# Altium schematic sheet 990207_Schematic.SchDoc
size A
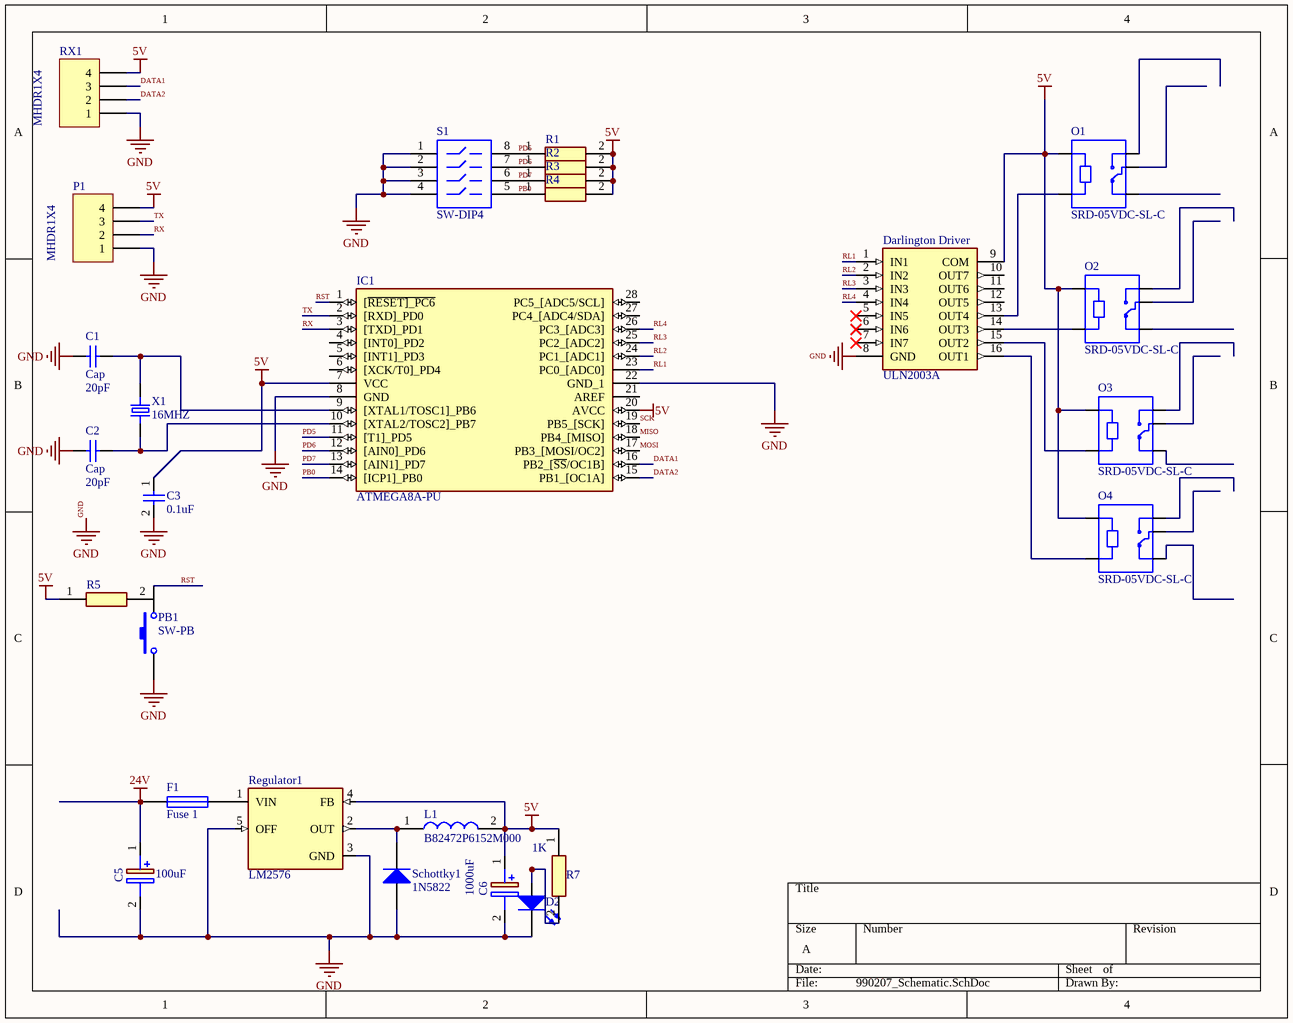
[diagram p0: 990207_Schematic.SchDoc]

## Parts
C1  Cap  value 20pF  [RAD-0.3]
C2  Cap  value 20pF  [RAD-0.3]
C3  0.1uF  [RAD-0.3]
C5  100uF  [CAPPRD550W60D1050H2150]
C6  1000uF  [CAPPRD550W60D1050H2150]
D2  LED0  [LED-0]  (value not drawn)
Darlington_Driver  ULN2003A  [DIP794W56P254L1918H533Q16N]
F1  Fuse 1  [PIN-W2/E2.8]
IC1  ATMEGA8A-PU  [DIP794W53P254L3467H457Q28N]
L1  B82472P6152M000  [INDPM7474X450N]
O1  SRD-05VDC-SL-C  [RELAY_SRD-05VDC-SL-C]
O2  SRD-05VDC-SL-C  [RELAY_SRD-05VDC-SL-C]
O3  SRD-05VDC-SL-C  [RELAY_SRD-05VDC-SL-C]
O4  SRD-05VDC-SL-C  [RELAY_SRD-05VDC-SL-C]
P1  MHDR1X4  [MHDR1X4]
PB1  SW-PB  [SPST-2]
R1  CRCW120610M0FKEA  [RESC3216X60N]  (value not drawn)
R2  CRCW120610M0FKEA  [RESC3216X60N]  (value not drawn)
R3  CRCW120610M0FKEA  [RESC3216X60N]  (value not drawn)
R4  CRCW120610M0FKEA  [RESC3216X60N]  (value not drawn)
R5  CRCW120610M0FKEA  [RESC3216X60N]  (value not drawn)
R7  1K  [RESC3216X60N]
Regulator1  LM2576  [TO220-5]
RX1  MHDR1X4  [MHDR1X4]
S1  SW-DIP4  [DIP-8]
Schottky1  1N5822  [DO-41]
X1  16MHZ  [XTAL_ABLS-8.000MHZ-B2-T]

## Nets
5V: C3.1 C6.1(+) Darlington_Driver.9(COM) IC1.7(VCC) IC1.20(AVCC) L1.2 O1.A1 O2.A1 O3.A1 O4.A1 P1.4 R1.2 R2.2 R3.2 R4.2 R5.1 R7.1 Regulator1.4(FB) RX1.4
24V: C5.1(+) F1.1
GND: C1.1 C2.1 C3.2 C5.2(-) C6.2(-) D2.2(K) Darlington_Driver.8(GND) IC1.8(GND) IC1.22(GND_1) P1.1 PB1.1 Regulator1.3(GND) Regulator1.5(OFF) RX1.1 S1.1 S1.2 S1.3 S1.4 Schottky1.1(A)
DATA1: IC1.16(PB2_[~{SS}/OC1B]) RX1.3
DATA2: IC1.15(PB1_[OC1A]) RX1.2
MISO: IC1.18(PB4_[MISO])
MOSI: IC1.17(PB3_[MOSI/OC2])
PB0: IC1.14([ICP1]_PB0) R4.1 S1.5
PD5: IC1.11([T1]_PD5) R1.1 S1.8
PD6: IC1.12([AIN0]_PD6) R2.1 S1.7
PD7: IC1.13([AIN1]_PD7) R3.1 S1.6
RL1: Darlington_Driver.1(IN1) IC1.23(PC0_[ADC0])
RL2: Darlington_Driver.2(IN2) IC1.24(PC1_[ADC1])
RL3: Darlington_Driver.3(IN3) IC1.25(PC2_[ADC2])
RL4: Darlington_Driver.4(IN4) IC1.26(PC3_[ADC3])
RST: IC1.1([~{RESET]_PC6}) PB1.2
RX: IC1.3([TXD]_PD1) P1.2
SCK: IC1.19(PB5_[SCK])
TX: IC1.2([RXD]_PD0) P1.3
NetC1_2: C1.2 IC1.9([XTAL1/TOSC1]_PB6) X1.2
NetC2_2: C2.2 IC1.10([XTAL2/TOSC2]_PB7) X1.1
NetD2_1: D2.1(A) R7.2
NetDarlington_Driver_13: Darlington_Driver.13(OUT4) O1.A2
NetDarlington_Driver_14: Darlington_Driver.14(OUT3) O2.A2
NetDarlington_Driver_15: Darlington_Driver.15(OUT2) O3.A2
NetDarlington_Driver_16: Darlington_Driver.16(OUT1) O4.A2
NetF1_2: F1.2 Regulator1.1(VIN)
NetL1_1: L1.1 Regulator1.2(OUT) Schottky1.2(K)

Not connected (* = marked no-connect by the designer): Darlington_Driver 5(IN5)* 6(IN6)* 7(IN7)* 10(OUT7) 11(OUT6) 12(OUT5); IC1 4([INT0]_PD2) 5([INT1]_PD3) 6([XCK/T0]_PD4) 21(AREF) 27(PC4_[ADC4/SDA]) 28(PC5_[ADC5/SCL]); O1 COM NC NO; O2 COM NC NO; O3 COM NC NO; O4 COM NC NO; R5 2

## Library data of the parts
C1-C3 = Cap: Capacitor; Published: 8-Jun-2000; LatestRevisionDate: 17-Jul-2002; LatestRevisionNote: Re-released for DXP Platform.; PackageReference: RAD-0.3; Publisher: Altium Limited; PackageDescription: Radial Cap, Thru-Hole; 2 Leads; 0.3 in Pin Spacing
C5 C6 = 108CKE025M: Capacitor Polarised; Manufacturer_Name: Cinch; Datasheet Link: https://componentsearchengine.com/Datasheets/2/108CKE025M.pdf; Height: 21.5mm; Manufacturer_Part_Number: 108CKE025M
D2 = LED0: Typical INFRARED GaAs LED; Published: 8-Jun-2000; LatestRevisionDate: 08-Jul-2005; LatestRevisionNote: Mech Layer 1 removed.; PackageReference: LED-0; Publisher: Altium Limited; PackageDescription: LED; 2 Leads
Darlington_Driver = ULN2003A: Integrated Circuit; Manufacturer_Name: STMicroelectronics; Allied_Number: 70014189; Datasheet Link: http://www.st.com/web/en/resource/technical/document/datasheet/CD00001244.pdf; Height: 5.33mm; Manufacturer_Part_Number: ULN2003A; Mouser Part Number: 511-ULN2003A; Mouser Price/Stock: https://www.mouser.com/Search/Refine.aspx?Keyword=511-ULN2003A; RS Part Number: 6868209; RS Price/Stock: http://uk.rs-online.com/web/p/products/6868209; Allied Price/Stock: http://www.alliedelec.com/stmicroelectronics-uln2003a/70014189/
F1 = Fuse 1: Fuse; Published: 8-Jun-2000; LatestRevisionDate: 17-Jul-2002; LatestRevisionNote: Re-released for DXP Platform.; PackageReference: PIN-W2/E2.8; Publisher: Altium Limited; PackageDescription: Thru-Hole; 2 Leads
IC1 = ATMEGA8A-PU: Integrated Circuit; Manufacturer_Name: Microchip; Datasheet Link: http://www.atmel.com/images/atmel-8159-8-bit-avr-microcontroller-atmega8a_summary.pdf; Height: 4.572mm; Manufacturer_Part_Number: ATMEGA8A-PU; Mouser Part Number: 556-ATMEGA8A-PU; Mouser Price/Stock: https://www.mouser.com/Search/Refine.aspx?Keyword=556-ATMEGA8A-PU; RS Part Number: 1310372P; RS Price/Stock: http://uk.rs-online.com/web/p/products/1310372P
L1 = B82472P6152M000: Inductor; Manufacturer_Name: EPCOS; Datasheet Link: https://www.tdk-electronics.tdk.com/inf/30/db/ind_2008/b82472p6.pdf; Height: 4.5mm; Manufacturer_Part_Number: B82472P6152M000; Mouser Part Number: 871-B82472P6152M000; Mouser Price/Stock: https://www.mouser.com/Search/Refine.aspx?Keyword=871-B82472P6152M000
O1-O4 = SRD-05VDC-SL-C: 5V Trigger Relay Module For Arduino And Raspberry Pi 5V Trigger Relay Module For Arduino And Raspberry Pi; MF: Songle Relay; Package: None; Availability: Unavailable; Value: *; MP: SRD-05VDC-SL-C; SnapEDA_Link: https://www.snapeda.com/parts/SRD-05VDC-SL-C/Songle%20Relay/view-part/1029484/?ref=snap; Price: None
P1 RX1 = MHDR1X4: Header, 4-Pin; LatestRevisionDate: 17-Jul-2002; LatestRevisionNote: Re-released for DXP Platform.; Publisher: Altium Limited
PB1 = SW-PB: Switch; Published: 24-Mar-1999; LatestRevisionDate: 17-Jul-2002; LatestRevisionNote: Re-released for DXP Platform.; PackageReference: SPST-2; Publisher: Altium Limited; PackageDescription: Switch; 2 Leads
R1-R5 R7 = CRCW120610M0FKEA: Resistor; Manufacturer_Name: Vishay; Allied_Number: 70204450; Height: 0.6mm; Manufacturer_Part_Number: CRCW120610M0FKEA; Mouser Part Number: 71-CRCW1206-10M-E3; Mouser Price/Stock: https://www.mouser.com/Search/Refine.aspx?Keyword=71-CRCW1206-10M-E3; Allied Price/Stock: https://www.alliedelec.com/vishay-dale-crcw120610m0fkea/70204450/
Regulator1 = LM2576: Buck Switching Regulator IC Positive Fixed 5V 1 Output 3A TO-263-6, DÂ²Pak _5 Leads + Tab_, TO-263BA; MF: Texas Instruments; Price: None; Package: TO-263-6 National Semiconductor; Value: *; MP: LM2576; Availability: Unavailable; SnapEDA_Link: https://www.snapeda.com/parts/LM2576/Texas%20Instruments/view-part/214937/?ref=snap
S1 = SW-DIP4: DIP Switch; Published: 24-Mar-1999; LatestRevisionDate: 17-Jul-2002; LatestRevisionNote: Re-released for DXP Platform.; PackageReference: DIP-8; Publisher: Altium Limited
Schottky1 = Diode 1N4001: 1 Amp General Purpose Rectifier; Published: 8-Jun-2000; LatestRevisionDate: 17-Jul-2002; LatestRevisionNote: Re-released for DXP Platform.; DatasheetVersion: 1998; PackageVersion: Aug-1999; PackageReference: DO-41; Publisher: Altium Limited; PackageDescription: Diode, Axial; Body 5.2 x 2.7 mm (LxDia. max), Lead Dia. 0.86 mm (max); Code_JEDEC: DO-204-AL; ComponentLink1Description: Manufacturer Link; ComponentLink1URL: http://www.fairchildsemi.com/; ComponentLink2Description: Datasheet; ComponentLink2URL: http://www.fairchildsemi.com/ds/1N%2F1N4001.pdf
X1 = ABLS-8.000MHZ-B2-T: 8MHz Â±20ppm Crystal 18pF 80 Ohms HC-49/US; MF: Abracon LLC; Value: *; MP: ABLS-8.000MHZ-B2; Package: HC-49/US Abracon LLC; SnapEDA_Link: https://www.snapeda.com/parts/ABLS-8.000MHZ-B2/Abracon%20LLC/view-part/2753215/?ref=snap; Price: None; Availability: Unavailable